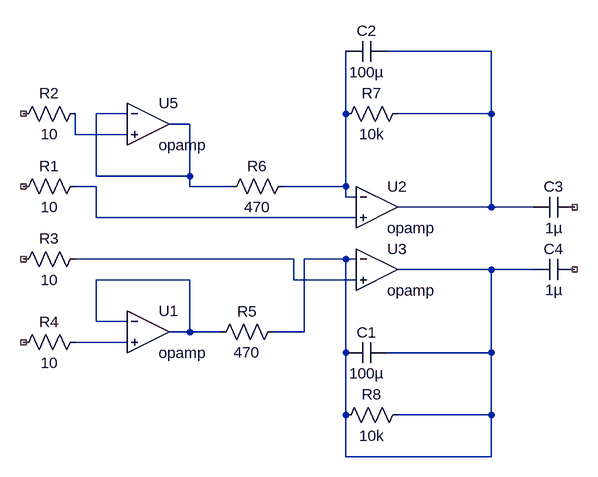
[diagram p0: schematic SDR-TayloeDetector-AmpStage.asc]
SDR-TayloeDetector-AmpStage.asc, the LTspice schematic file:
Version 4.1
SHEET 1 880 680
WIRE 608 -96 448 -96
WIRE 48 0 0 0
WIRE 384 0 384 -96
WIRE 608 0 608 -96
WIRE 608 0 464 0
WIRE 144 16 112 16
WIRE -32 32 -32 0
WIRE 48 32 -32 32
WIRE 0 96 0 0
WIRE 144 96 144 16
WIRE 144 96 0 96
WIRE 0 112 -32 112
WIRE 144 112 144 96
WIRE 208 112 144 112
WIRE 384 112 384 0
WIRE 384 112 288 112
WIRE 384 128 384 112
WIRE 400 128 384 128
WIRE 608 144 608 0
WIRE 608 144 464 144
WIRE 672 144 608 144
WIRE 0 160 0 112
WIRE 400 160 0 160
WIRE 304 224 -32 224
WIRE 384 224 320 224
WIRE 400 224 384 224
WIRE 608 240 464 240
WIRE 672 240 608 240
WIRE 144 256 0 256
WIRE 304 256 304 224
WIRE 400 256 304 256
WIRE 0 320 0 256
WIRE 48 320 0 320
WIRE 144 336 144 256
WIRE 144 336 112 336
WIRE 192 336 144 336
WIRE 320 336 320 224
WIRE 320 336 272 336
WIRE 48 352 -32 352
WIRE 384 368 384 224
WIRE 608 368 608 240
WIRE 608 368 448 368
WIRE 384 464 384 368
WIRE 608 464 608 368
WIRE 608 464 464 464
WIRE 384 528 384 464
WIRE 608 528 608 464
WIRE 608 528 384 528
SYMBOL res -16 96 R90
WINDOW 0 0 56 VBottom 2
WINDOW 3 32 56 VTop 2
SYMATTR InstName R1
SYMATTR Value 10
SYMBOL res -16 -16 R90
WINDOW 0 0 56 VBottom 2
WINDOW 3 32 56 VTop 2
SYMATTR InstName R2
SYMATTR Value 10
SYMBOL res -16 208 R90
WINDOW 0 0 56 VBottom 2
WINDOW 3 32 56 VTop 2
SYMATTR InstName R3
SYMATTR Value 10
SYMBOL res -16 336 R90
WINDOW 0 0 56 VBottom 2
WINDOW 3 32 56 VTop 2
SYMATTR InstName R4
SYMATTR Value 10
SYMBOL OpAmps\\opamp 80 -48 R0
SYMATTR InstName U5
SYMBOL OpAmps\\opamp 80 272 R0
SYMATTR InstName U1
SYMBOL OpAmps\\opamp 432 80 R0
SYMATTR InstName U2
SYMBOL OpAmps\\opamp 432 176 R0
SYMATTR InstName U3
SYMBOL res 288 320 R90
WINDOW 0 0 56 VBottom 2
WINDOW 3 32 56 VTop 2
SYMATTR InstName R5
SYMATTR Value 470
SYMBOL res 304 96 R90
WINDOW 0 0 56 VBottom 2
WINDOW 3 32 56 VTop 2
SYMATTR InstName R6
SYMATTR Value 470
SYMBOL cap 448 352 R90
WINDOW 0 0 32 VBottom 2
WINDOW 3 32 32 VTop 2
SYMATTR InstName C1
SYMATTR Value 100µ
SYMBOL cap 448 -112 R90
WINDOW 0 0 32 VBottom 2
WINDOW 3 32 32 VTop 2
SYMATTR InstName C2
SYMATTR Value 100µ
SYMBOL cap 736 128 R90
WINDOW 0 0 32 VBottom 2
WINDOW 3 32 32 VTop 2
SYMATTR InstName C3
SYMATTR Value 1µ
SYMBOL cap 736 224 R90
WINDOW 0 0 32 VBottom 2
WINDOW 3 32 32 VTop 2
SYMATTR InstName C4
SYMATTR Value 1µ
SYMBOL res 480 -16 R90
WINDOW 0 0 56 VBottom 2
WINDOW 3 32 56 VTop 2
SYMATTR InstName R7
SYMATTR Value 10k
SYMBOL res 480 448 R90
WINDOW 0 0 56 VBottom 2
WINDOW 3 32 56 VTop 2
SYMATTR InstName R8
SYMATTR Value 10k

The netlist it stands for:
* SDR-TayloeDetector-AmpStage.asc
R1 N005 NC_01 10
R2 N004 NC_02 10
R3 N006 NC_03 10
R4 N009 NC_04 10
X§U5 N002 N004 N002 opamp Aol=100K GBW=10Meg  ; pins invin noninvin out
X§U1 N008 N009 N008 opamp Aol=100K GBW=10Meg  ; pins invin noninvin out
X§U2 N003 N005 N001 opamp Aol=100K GBW=10Meg  ; pins invin noninvin out
X§U3 N007 N006 N007 opamp Aol=100K GBW=10Meg  ; pins invin noninvin out
R5 N007 N008 470
R6 N003 N002 470
C1 N007 N007 100µ
C2 N001 N003 100µ
C3 NC_05 N001 1µ
C4 NC_06 N007 1µ
R7 N001 N003 10k
R8 N007 N007 10k
.backanno
.end